# EAGLE design web_plugin (EAGLE 5.10)
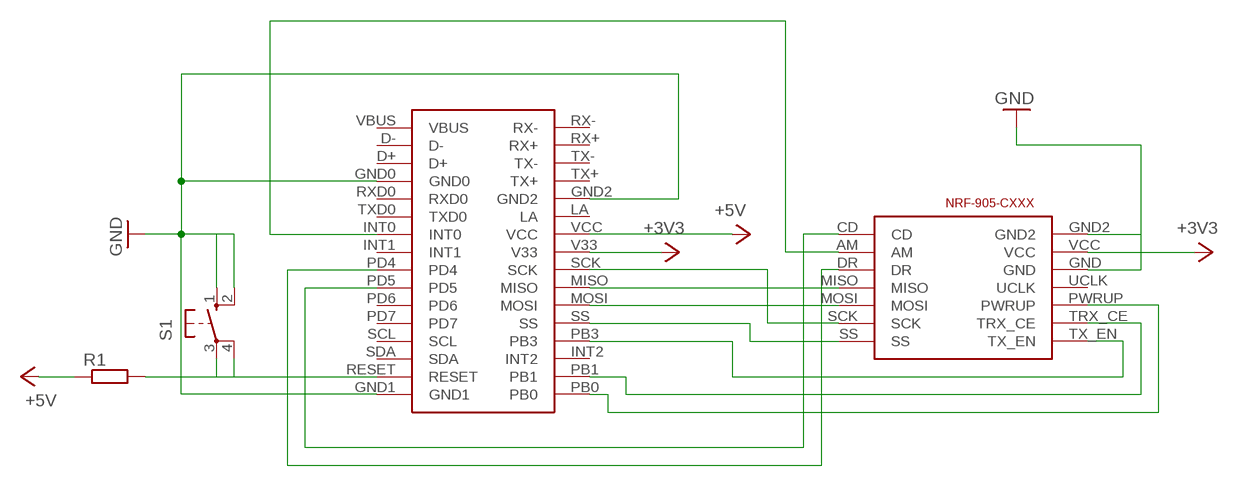
[diagram p0: schematic, sheet 1]

## Parts
R1  R-EU_0204/5  [0204/5]
S1  10-XX  [B3F-10XX]
U$1  CRUMB644  [CRUMB644]
U$2  NRF-905-CXXX  [NRF905-CXXX]

## Nets
+3V3: U$1.V33 U$2.VCC
+5V: R1.1 U$1.VCC
GND: S1.1(S) S1.2(S1) U$1.GND0 U$1.GND1 U$1.GND2 U$2.GND U$2.GND2
N$1: U$1.PB3 U$2.TX_EN
N$2: U$1.PB1 U$2.TRX_CE
N$3: U$1.MISO U$2.MISO
N$4: U$1.MOSI U$2.MOSI
N$5: U$1.SS U$2.SS
N$6: U$1.SCK U$2.SCK
N$7: U$1.INT0 U$2.AM
N$8: U$1.PB0 U$2.PWRUP
N$9: U$1.PD4 U$2.DR
N$10: U$1.PD5 U$2.CD
N$11: R1.2 S1.3(P) S1.4(P1) U$1.RESET
Unconnected: U$1.D+ U$1.D- U$1.INT1 U$1.INT2 U$1.LA U$1.PD6 U$1.PD7 U$1.RX+ U$1.RX- U$1.RXD0 U$1.SCL U$1.SDA U$1.TX+ U$1.TX- U$1.TXD0 U$1.VBUS U$2.UCLK

## Library data of the parts
R1 = resistor:R-EU_: RESISTOR, European symbol
S1 = switch-omron:10-XX: OMRON SWITCH
U$1 = crumb644:CRUMB644
U$2 = nrf905-Cxxx:NRF-905-CXXX

## Board
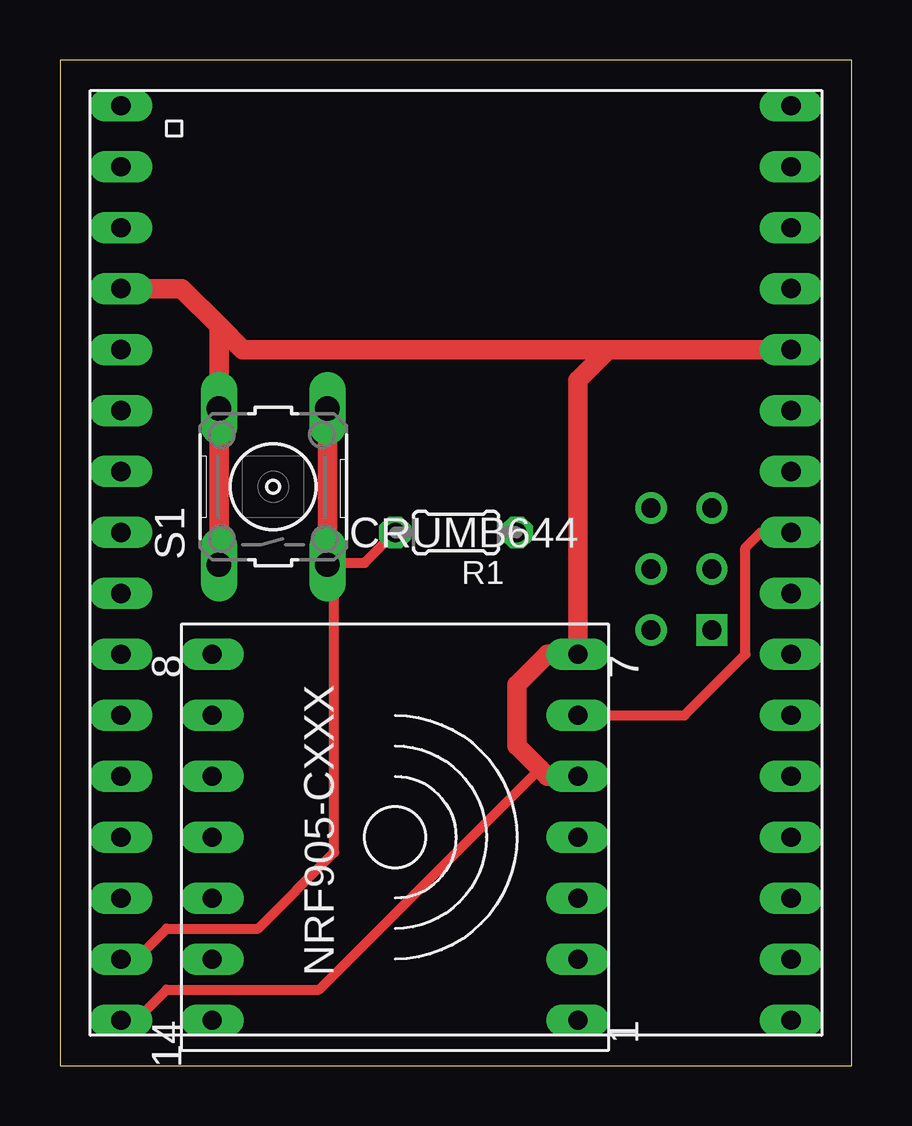
[diagram p1: board, top side]
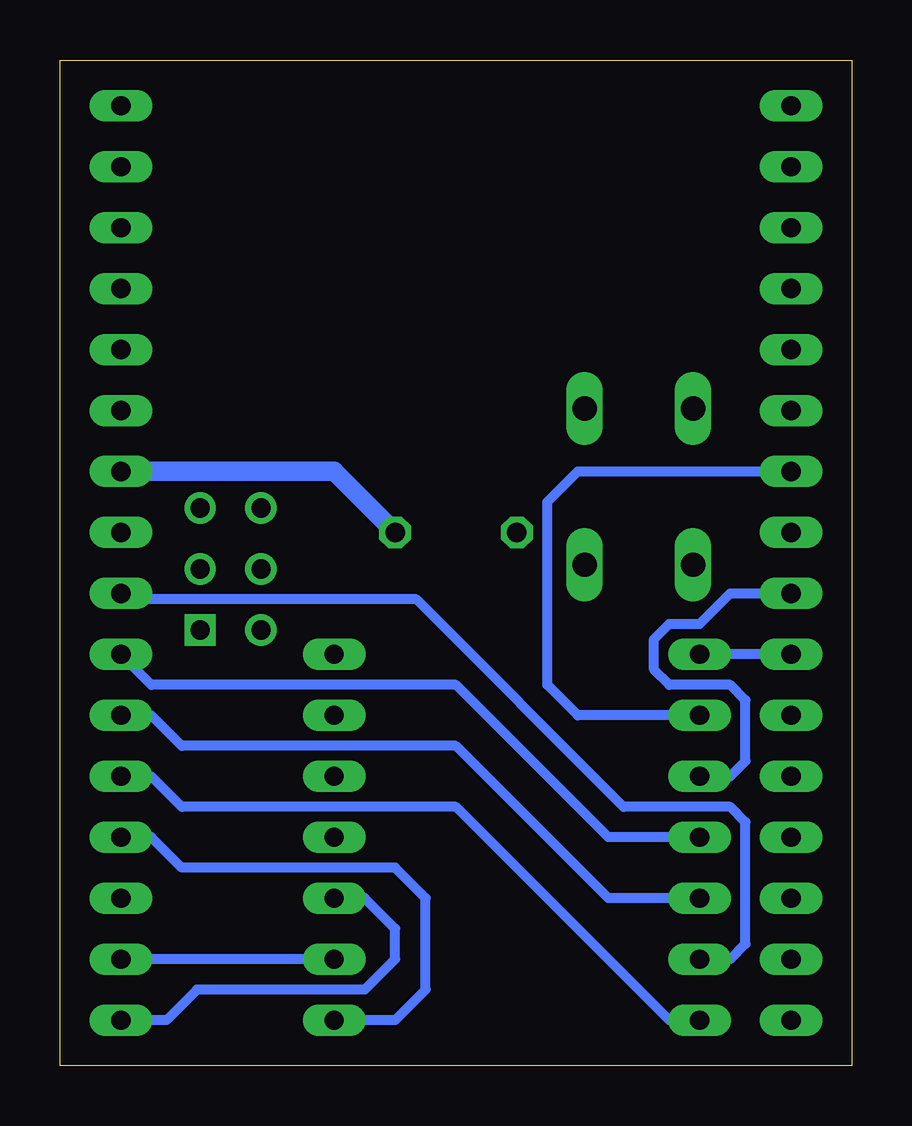
[diagram p2: board, bottom side, seen from below]

Size 33.02 x 41.91 mm. Coordinates in mm from the lower left corner, seen from the top.
Outline: 0,0 33.02,0 33.02,41.91 0,41.91 0,0
Copper layers (1*16): Top 0.035mm / dielectric 1.5mm / Bottom 0.035mm
Design rules "default": minimum track width 10mil, minimum drill 24mil, track to track 8mil, track to pad 8mil, pad to pad 8mil, via to via 8mil, smd to smd 8mil, copper to edge 40mil, drill to drill 8mil, minimum pad ring 10mil, minimum via ring 8mil, stop-mask expansion 4mil, vias tented up to drill 0mil, thermal gap 10mil

### Footprints (pad centres in the part's own frame; a part is rotated, then mirrored left to right if it is on the bottom)
0204/5 = drill 0.813 octagon: 1 -2.54,0; 2 2.54,0
B3F-10XX = drill 1.016 long: 1 -3.251,2.261; 2 3.251,2.261; 3 -3.251,-2.261; 4 3.251,-2.261
CRUMB644 = drill 0.8 long: D+ -13.97,13.97; D- -13.97,16.51; GND0 -13.97,11.43; GND1 -13.97,-19.05; GND2 13.97,8.89; INT0 -13.97,3.81; INT1 -13.97,1.27; INT2 13.97,-13.97; LA 13.97,6.35; MISO 13.97,-3.81; MOSI 13.97,-6.35; PB0 13.97,-19.05; PB1 13.97,-16.51; PB3 13.97,-11.43; PD4 -13.97,-1.27; PD5 -13.97,-3.81; PD6 -13.97,-6.35; PD7 -13.97,-8.89; RESET -13.97,-16.51; RX+ 13.97,16.51; RX- 13.97,19.05; RXD0 -13.97,8.89; SCK 13.97,-1.27; SCL -13.97,-11.43; SDA -13.97,-13.97; SS 13.97,-8.89; TX+ 13.97,11.43; TX- 13.97,13.97; TXD0 -13.97,6.35; V33 13.97,1.27; VBUS -13.97,19.05; VCC 13.97,3.81 | drill 0.8 square: P$1 10.668,-2.794 | drill 0.8 round: P$2 8.128,-2.794; P$3 8.128,-0.254; P$4 10.668,-0.254; P$5 10.668,2.286; P$6 8.128,2.286
NRF905-CXXX = drill 0.8 long: AM -5.08,-7.62; CD -7.62,-7.62; DR -2.54,-7.62; GND -2.54,7.62; GND2 -7.62,7.62; MISO 0,-7.62; MOSI 2.54,-7.62; PWRUP 2.54,7.62; SCK 5.08,-7.62; SS 7.62,-7.62; TRX_CE 5.08,7.62; TX_EN 7.62,7.62; UCLK 0,7.62; VCC -5.08,7.62

### Placement (x,y rotation side)
R1  16.51,22.23 180 top
S1  8.89,24.13 90 top
U$1  16.51,20.95 0 top
U$2  13.97,9.53 270 top

### Tracks (layer width: path | path; a pad name or v marks a point on that pad's centre or on a via)
+3V3
  Top 0.406: U$2.VCC 26.04,14.61 28.57,17.14 28.57,21.59 29.21,22.23 U$1.V33
+5V
  Bottom 0.813: U$1.VCC 21.59,24.77 R1.1
GND
  Top 0.406: U$1.GND1 3.18,1.91 4.45,3.17 10.79,3.17 20,12.38
  Top 0.813: U$2.GND 20.32,12.06 20,12.38 19.05,13.34 19.05,15.88 20.32,17.14 U$2.GND2 21.59,28.57 22.86,29.84 | S1.1 S1.2 6.63,30.84 | 6.63,30.84 5.08,32.38 U$1.GND0 | 22.86,29.84 7.62,29.84 6.63,30.84 | 22.86,29.84 U$1.GND2
N$1
  Bottom 0.406: U$2.TX_EN 19.05,1.91 17.78,3.17 17.78,6.99 19.05,8.26 27.94,8.26 29.21,9.53 U$1.PB3
N$2
  Bottom 0.406: U$2.TRX_CE U$1.PB1
N$3
  Bottom 0.406: U$2.MISO 10.16,9.53 16.51,15.88 29.21,15.88 U$1.MISO
N$4
  Bottom 0.406: U$2.MOSI 10.16,6.99 16.51,13.34 27.94,13.34 29.21,14.61 U$1.MOSI
N$5
  Bottom 0.406: U$1.SS 29.21,12.06 27.94,10.79 16.51,10.79 7.62,1.91 U$2.SS
N$6
  Bottom 0.406: U$2.SCK 5.08,4.45 4.45,5.08 4.45,10.16 5.08,10.79 9.53,10.79 18.16,19.43 30.23,19.43 U$1.SCK
N$7
  Bottom 0.406: U$2.AM 11.43,14.61 12.7,15.88 12.7,23.5 11.43,24.77 U$1.INT0
N$8
  Bottom 0.406: U$2.PWRUP 20.32,6.99 19.05,5.71 19.05,4.45 20.32,3.17 27.3,3.17 28.57,1.91 U$1.PB0
N$9
  Bottom 0.406: U$2.DR 5.08,12.06 4.45,12.7 4.45,15.24 5.08,15.88 7.62,15.88 8.26,16.51 8.26,17.78 7.62,18.41 6.35,18.41 5.08,19.68 U$1.PD4
N$10
  Bottom 0.406: U$1.PD5 U$2.CD
N$11
  Top 0.406: R1.2 12.7,20.95 11.23,20.95 S1.3 11.43,20.6 11.43,8.89 8.26,5.71 4.45,5.71 3.18,4.45 U$1.RESET
  Top 0.813: S1.3 S1.4